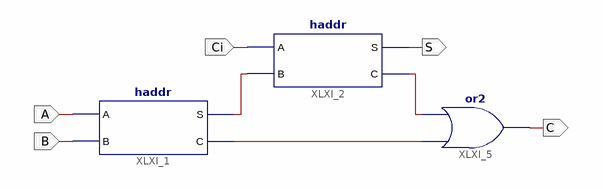
[diagram p0: schematic sheet 1]
// Xilinx ISE schematic faddr.sch (artix7) as structural Verilog: 3 symbols, 5 ports
module faddr (
  input  A,
  input  B,
  input  Ci,
  output S,
  output C
);

  wire XLXN_3, XLXN_8, XLXN_14;

  haddr XLXI_1 (.A(A), .B(B), .S(XLXN_3), .C(XLXN_14));
  haddr XLXI_2 (.A(Ci), .B(XLXN_3), .S(S), .C(XLXN_8));
  or XLXI_5 (C, XLXN_14, XLXN_8);
endmodule
